# EAGLE schematic waterworx (EAGLE 6.2)
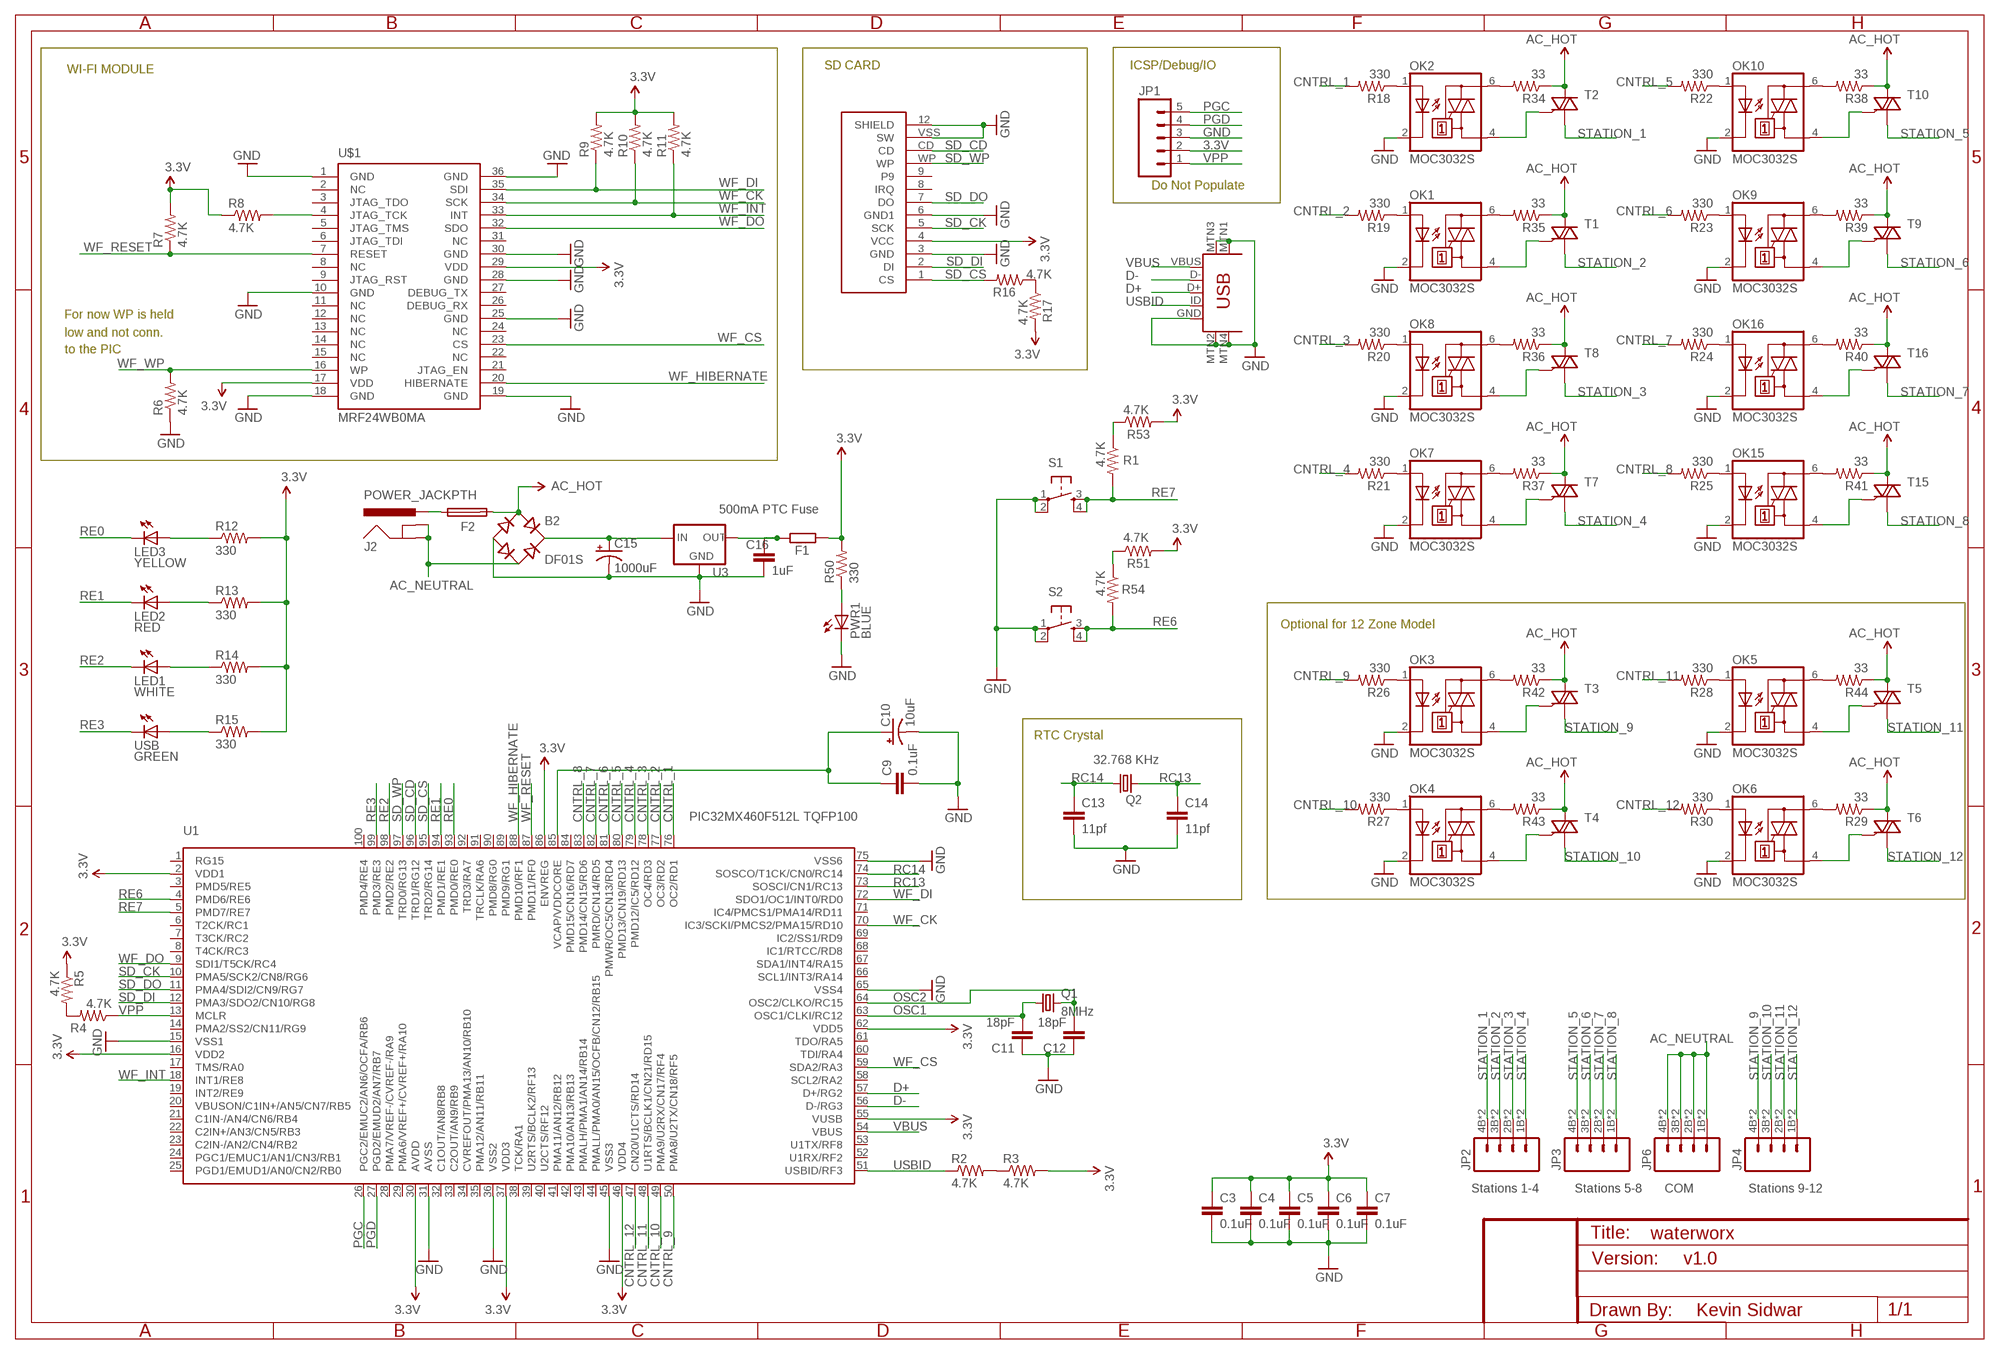
[diagram p0: schematic, sheet 1]

## Parts
B2  DF01S  [DFS]
C3  0.1uF  CAP0603  [0603]
C4  0.1uF  CAP0603  [0603]
C5  0.1uF  CAP0603  [0603]
C6  0.1uF  CAP0603  [0603]
C7  0.1uF  CAP0603  [0603]
C9  0.1uF  CAP0603  [0603]
C10  10uF  CAP_POL3528  [EIA3528]
C11  18pF  CAP0603  [0603]
C12  18pF  CAP0603  [0603]
C13  11pf  CAP0603  [0603]
C14  11pf  CAP0603  [0603]
C15  1000uF  CPOL-USE7.5-18  [E7,5-18]
C16  1uF  CAP0603-CAP  [0603-CAP]
F1  500mA PTC Fuse  R-EU_M1206  [M1206]
F2  LITTLEFUSENANO  [NANO2_HOLDER]
J2  POWER_JACKPTH  [POWER_JACK_PTH]
JP1  M05LOCK  [1X05_LOCK]
JP2  Stations 1-4  M04PHX  [PHOENIX_TERMINAL_4]
JP3  Stations 5-8  M04PHX  [PHOENIX_TERMINAL_4]
JP4  Stations 9-12  M04PHX  [PHOENIX_TERMINAL_4]
JP6  COM  M04PHX  [PHOENIX_TERMINAL_4]
LED1  WHITE  LED0603  [LED-0603]
LED2  RED  LED0603  [LED-0603]
LED3  YELLOW  LED0603  [LED-0603]
OK1  MOC3032S  [DIL6-SMD]
OK2  MOC3032S  [DIL6-SMD]
OK3  MOC3032S  [DIL6-SMD]
OK4  MOC3032S  [DIL6-SMD]
OK5  MOC3032S  [DIL6-SMD]
OK6  MOC3032S  [DIL6-SMD]
OK7  MOC3032S  [DIL6-SMD]
OK8  MOC3032S  [DIL6-SMD]
OK9  MOC3032S  [DIL6-SMD]
OK10  MOC3032S  [DIL6-SMD]
OK15  MOC3032S  [DIL6-SMD]
OK16  MOC3032S  [DIL6-SMD]
PWR1  BLUE  LED0603  [LED-0603]
Q1  8MHz  CRYSTAL5X3  [CRYSTAL-SMD-5X3]
Q2  32.768 KHz  CRYSTAL4X2  [CRYSTAL-SMD-4X2]
R1  4.7K  RESISTOR0603  [0603]
R2  4.7K  RESISTOR0603-RES  [0603-RES]
R3  4.7K  RESISTOR0603-RES  [0603-RES]
R4  4.7K  RESISTOR0603-RES  [0603-RES]
R5  4.7K  RESISTOR0603-RES  [0603-RES]
R6  4.7K  RESISTOR0603-RES  [0603-RES]
R7  4.7K  RESISTOR0603-RES  [0603-RES]
R8  4.7K  RESISTOR0603-RES  [0603-RES]
R9  4.7K  RESISTOR0603-RES  [0603-RES]
R10  4.7K  RESISTOR0603-RES  [0603-RES]
R11  4.7K  RESISTOR0603-RES  [0603-RES]
R12  330  RESISTOR0603-RES  [0603-RES]
R13  330  RESISTOR0603-RES  [0603-RES]
R14  330  RESISTOR0603-RES  [0603-RES]
R15  330  RESISTOR0603-RES  [0603-RES]
R16  4.7K  RESISTOR0603-RES  [0603-RES]
R17  4.7K  RESISTOR0603-RES  [0603-RES]
R18  330  RESISTOR0603-RES  [0603-RES]
R19  330  RESISTOR0603-RES  [0603-RES]
R20  330  RESISTOR0603-RES  [0603-RES]
R21  330  RESISTOR0603-RES  [0603-RES]
R22  330  RESISTOR0603-RES  [0603-RES]
R23  330  RESISTOR0603-RES  [0603-RES]
R24  330  RESISTOR0603-RES  [0603-RES]
R25  330  RESISTOR0603-RES  [0603-RES]
R26  330  RESISTOR0603-RES  [0603-RES]
R27  330  RESISTOR0603-RES  [0603-RES]
R28  330  RESISTOR0603-RES  [0603-RES]
R29  33  RESISTOR0603-RES  [0603-RES]
R30  330  RESISTOR0603-RES  [0603-RES]
R34  33  RESISTOR0603-RES  [0603-RES]
R35  33  RESISTOR0603-RES  [0603-RES]
R36  33  RESISTOR0603-RES  [0603-RES]
R37  33  RESISTOR0603-RES  [0603-RES]
R38  33  RESISTOR0603-RES  [0603-RES]
R39  33  RESISTOR0603-RES  [0603-RES]
R40  33  RESISTOR0603-RES  [0603-RES]
R41  33  RESISTOR0603-RES  [0603-RES]
R42  33  RESISTOR0603-RES  [0603-RES]
R43  33  RESISTOR0603-RES  [0603-RES]
R44  33  RESISTOR0603-RES  [0603-RES]
R50  330  RESISTOR0603-RES  [0603-RES]
R51  4.7K  RESISTOR0603  [0603]
R53  4.7K  RESISTOR0603  [0603]
R54  4.7K  RESISTOR0603  [0603]
S1  TAC_SWITCHB3FS  [SWITCH-OMRON]
S2  TAC_SWITCHB3FS  [SWITCH-OMRON]
T1  LF-TRIACSOT223  [SOT223]
T2  LF-TRIACSOT223  [SOT223]
T3  LF-TRIACSOT223  [SOT223]
T4  LF-TRIACSOT223  [SOT223]
T5  LF-TRIACSOT223  [SOT223]
T6  LF-TRIACSOT223  [SOT223]
T7  LF-TRIACSOT223  [SOT223]
T8  LF-TRIACSOT223  [SOT223]
T9  LF-TRIACSOT223  [SOT223]
T10  LF-TRIACSOT223  [SOT223]
T15  LF-TRIACSOT223  [SOT223]
T16  LF-TRIACSOT223  [SOT223]
U1  PIC32MX460F512L TQFP100  PIC32MX4XXLTQFP100  [TQFP100]
U3  RECOM_X.X_REG78XX  [RECOM]
U$1  MRF24WB0MA  [SMD_MRF]
U$2  SD_CARD_SOCKETALPS  [SD_ALPS]
U$21  USB-MINIB-5PIN  [USB-MINIB]
USB  GREEN  LED0603  [LED-0603]

## Nets
3.3V: C3.1 C4.1 C5.1 C6.1 C7.1 F1.1 JP1.2 R3.2 R5.1 R7.2 R8.1 R9.2 R10.2 R11.2 R12.2 R13.2 R14.2 R15.2 R17.2 R50.2 R51.2 R53.2 U1.2(VDD1) U1.16(VDD2) U1.30(AVDD) U1.37(VDD3) U1.46(VDD4) U1.55(VUSB) U1.62(VDD5) U1.86(ENVREG) U$1.17(VDD) U$1.29(VDD) U$2.4(VCC)
AC_HOT: B2.AC1 F2.2 R29.1 R34.1 R35.1 R36.1 R37.1 R38.1 R39.1 R40.1 R41.1 R42.1 R43.1 R44.1 T1.2(A2) T2.2(A2) T3.2(A2) T4.2(A2) T5.2(A2) T6.2(A2) T7.2(A2) T8.2(A2) T9.2(A2) T10.2(A2) T15.2(A2) T16.2(A2)
AC_NEUTRAL: B2.AC2 J2.GND J2.GNDBREAK JP6.1B JP6.1T JP6.2B JP6.2T JP6.3B JP6.3T JP6.4B JP6.4T
CNTRL_1: R18.2 U1.76(OC2/RD1)
CNTRL_2: R19.2 U1.77(OC3/RD2)
CNTRL_3: R20.2 U1.78(OC4/RD3)
CNTRL_4: R21.2 U1.79(PMD12/IC5/RD12)
CNTRL_5: R22.2 U1.80(PMD13/CN19/RD13)
CNTRL_6: R23.2 U1.81(PMWR/OC5/CN13/RD4)
CNTRL_7: R24.2 U1.82(PMRD/CN14/RD5)
CNTRL_8: R25.2 U1.83(PMD14/CN15/RD6)
CNTRL_9: R26.2 U1.50(PMA8/U2TX/CN18/RF5)
CNTRL_10: R27.2 U1.49(PMA9/U2RX/CN17/RF4)
CNTRL_11: R28.2 U1.48(U1RTS/BCLK1/CN21/RD15)
CNTRL_12: R30.2 U1.47(CN20/U1CTS/RD14)
D+: U1.57(D+/RG2) U$21.D+
D-: U1.56(D-/RG3) U$21.D-
GND: B2.- C3.2 C4.2 C5.2 C6.2 C7.2 C9.2 C10.C(-) C11.1 C12.1 C13.2 C14.2 C15.- C16.2 JP1.3 OK1.2(C) OK2.2(C) OK3.2(C) OK4.2(C) OK5.2(C) OK6.2(C) OK7.2(C) OK8.2(C) OK9.2(C) OK10.2(C) OK15.2(C) OK16.2(C) PWR1.C R6.1 S1.1 S1.2 S2.1 S2.2 U1.15(VSS1) U1.31(AVSS) U1.36(VSS2) U1.45(VSS3) U1.65(VSS4) U1.75(VSS6) U3.GND U$1.1(GND) U$1.10(GND) U$1.18(GND) U$1.19(GND) U$1.25(GND) U$1.28(GND) U$1.30(GND) U$1.36(GND) U$2.3(GND) U$2.6(GND1) U$2.12(SHIELD) U$2.VSS(SW) U$21.GND U$21.MTN1(MTN2) U$21.MTN2(MTN3) U$21.MTN3(MTN1) U$21.MTN4
N$1: OK9.1(A) R23.1
N$2: OK1.1(A) R19.1
N$3: R51.1 R54.1
N$4: R1.1 R53.1
N$5: R8.2 U$1.4(JTAG_TCK)
N$6: OK1.6(A2) R35.2
N$7: OK9.6(A2) R39.2
N$8: OK1.4(A1) T1.3(G)
N$9: OK2.1(A) R18.1
N$10: R16.1 R17.1
N$11: R4.2 R5.2
N$12: OK2.6(A2) R34.2
N$13: OK9.4(A1) T9.3(G)
N$14: OK2.4(A1) T2.3(G)
N$15: R2.2 R3.1
N$16: B2.+ C15.+ U3.VIN(IN)
N$17: OK3.1(A) R26.1
N$18: OK3.6(A2) R42.2
N$19: PWR1.A R50.1
N$20: R15.1 USB.A
N$21: OK3.4(A1) T3.3(G)
N$22: LED1.A R14.1
N$23: LED2.A R13.1
N$24: C16.1 F1.2 U3.VOUT(OUT)
N$25: OK6.1(A) R30.1
N$26: OK4.1(A) R27.1
N$27: OK4.6(A2) R43.2
N$28: OK10.1(A) R22.1
N$29: OK4.4(A1) T4.3(G)
N$30: OK6.6(A2) R29.2
N$31: OK6.4(A1) T6.3(G)
N$32: OK5.1(A) R28.1
N$33: OK5.6(A2) R44.2
N$34: OK10.6(A2) R38.2
N$35: LED3.A R12.1
N$36: OK5.4(A1) T5.3(G)
N$37: F2.1 J2.PWR
N$41: OK10.4(A1) T10.3(G)
N$45: OK7.1(A) R21.1
N$46: OK7.6(A2) R37.2
N$48: OK7.4(A1) T7.3(G)
N$51: OK8.1(A) R20.1
N$52: OK8.6(A2) R36.2
N$54: OK8.4(A1) T8.3(G)
N$76: OK15.1(A) R25.1
N$77: OK15.6(A2) R41.2
N$78: OK15.4(A1) T15.3(G)
N$81: OK16.1(A) R24.1
N$82: OK16.6(A2) R40.2
N$83: OK16.4(A1) T16.3(G)
N$110: C9.1 C10.A(+) U1.85(VCAP/VDDCORE)
OSC1: C11.2 Q1.1 U1.63(OSC1/CLKI/RC12)
OSC2: C12.2 Q1.3 U1.64(OSC2/CLKO/RC15)
PGC: JP1.5 U1.26(PGC2/EMUC2/AN6/OCFA/RB6)
PGD: JP1.4 U1.27(PGD2/EMUD2/AN7/RB7)
RC13: C14.1 Q2.P$2 U1.73(SOSCI/CN1/RC13)
RC14: C13.1 Q2.P$1 U1.74(SOSCO/T1CK/CN0/RC14)
RE0: LED3.C U1.93(PMD0/RE0)
RE1: LED2.C U1.94(PMD1/RE1)
RE2: LED1.C U1.98(PMD2/RE2)
RE3: U1.99(PMD3/RE3) USB.C
RE6: R54.2 S2.3 S2.4 U1.4(PMD6/RE6)
RE7: R1.2 S1.3 S1.4 U1.5(PMD7/RE7)
SD_CD: U1.96(TRD1/RG12) U$2.CD
SD_CK: U1.10(PMA5/SCK2/CN8/RG6) U$2.5(SCK)
SD_CS: R16.2 U1.95(TRD2/RG14) U$2.1(CS)
SD_DI: U1.12(PMA3/SDO2/CN10/RG8) U$2.2(DI)
SD_DO: U1.11(PMA4/SDI2/CN9/RG7) U$2.7(DO)
SD_WP: U1.97(TRD0/RG13) U$2.WP
STATION_1: JP2.4B JP2.4T T2.1(A1)
STATION_2: JP2.3B JP2.3T T1.1(A1)
STATION_3: JP2.2B JP2.2T T8.1(A1)
STATION_4: JP2.1B JP2.1T T7.1(A1)
STATION_5: JP3.4B JP3.4T T10.1(A1)
STATION_6: JP3.3B JP3.3T T9.1(A1)
STATION_7: JP3.2B JP3.2T T16.1(A1)
STATION_8: JP3.1B JP3.1T T15.1(A1)
STATION_9: JP4.4B JP4.4T T3.1(A1)
STATION_10: JP4.3B JP4.3T T4.1(A1)
STATION_11: JP4.2B JP4.2T T5.1(A1)
STATION_12: JP4.1B JP4.1T T6.1(A1)
USBID: R2.1 U1.51(USBID/RF3) U$21.ID
VBUS: U1.54(VBUS) U$21.VBUS
VPP: JP1.1 R4.1 U1.13(MCLR)
WF_CK: R10.1 U1.70(IC3/SCKI/PMCS2/PMA15/RD10) U$1.34(SCK)
WF_CS: U1.59(SDA2/RA3) U$1.23(CS)
WF_DI: R9.1 U1.72(SDO1/OC1/INT0/RD0) U$1.35(SDI)
WF_DO: U1.9(SDI1/T5CK/RC4) U$1.32(SDO)
WF_HIBERNATE: U1.88(PMD10/RF1) U$1.20(HIBERNATE)
WF_INT: R11.1 U1.18(INT1/RE8) U$1.33(INT)
WF_RESET: R7.1 U1.87(PMD11/RF0) U$1.7(RESET)
WF_WP: R6.2 U$1.16(WP)
Unconnected: U1.1(RG15) U1.3(PMD5/RE5) U1.6(T2CK/RC1) U1.7(T3CK/RC2) U1.8(T4CK/RC3) U1.14(PMA2/SS2/CN11/RG9) U1.17(TMS/RA0) U1.19(INT2/RE9) U1.20(VBUSON/C1IN+/AN5/CN7/RB5) U1.21(C1IN-/AN4/CN6/RB4) U1.22(C2IN+/AN3/CN5/RB3) U1.23(C2IN-/AN2/CN4/RB2) U1.24(PGC1/EMUC1/AN1/CN3/RB1) U1.25(PGD1/EMUD1/AN0/CN2/RB0) U1.28(PMA7/VREF-/CVREF-/RA9) U1.29(PMA6/VREF+/CVREF+/RA10) U1.32(C1OUT/AN8/RB8) U1.33(C2OUT/AN9/RB9) U1.34(CVREFOUT/PMA13/AN10/RB10) U1.35(PMA12/AN11/RB11) U1.38(TCK/RA1) U1.39(U2RTS/BCLK2/RF13) U1.40(U2CTS/RF12) U1.41(PMA11/AN12/RB12) U1.42(PMA10/AN13/RB13) U1.43(PMALH/PMA1/AN14/RB14) U1.44(PMALL/PMA0/AN15/OCFB/CN12/RB15) U1.52(U1RX/RF2) U1.53(U1TX/RF8) U1.58(SCL2/RA2) U1.60(TDI/RA4) U1.61(TDO/RA5) U1.66(SCL1/INT3/RA14) U1.67(SDA1/INT4/RA15) U1.68(IC1/RTCC/RD8) U1.69(IC2/SS1/RD9) U1.71(IC4/PMCS1/PMA14/RD11) U1.84(PMD15/CN16/RD7) U1.89(PMD9/RG1) U1.90(PMD8/RG0) U1.91(TRCLK/RA6) U1.92(TRD3/RA7) U1.100(PMD4/RE4) U$1.2(NC) U$1.3(JTAG_TDO) U$1.5(JTAG_TMS) U$1.6(JTAG_TDI) U$1.8(NC) U$1.9(JTAG_RST) U$1.11(NC) U$1.12(NC) U$1.13(NC) U$1.14(NC) U$1.15(NC) U$1.21(JTAG_EN) U$1.22(NC) U$1.24(NC) U$1.26(DEBUG_RX) U$1.27(DEBUG_TX) U$1.31(NC) U$2.8(IRQ) U$2.9

## Notes on the sheet
- SD CARD | ICSP/Debug/IO
- WI-FI MODULE
- Do Not Populate
- For now WP is held
- low and not conn.
- to the PIC
- Optional for 12 Zone Model
- RTC Crystal
- v1.0
- Kevin Sidwar

## Library data of the parts
B2 = lizardworx:DF*S: Surface Mount Glass Passivated Bridge Rectifiers Source: Source: Comchip Bridge Rectifiers DF005S-G thru DF10S-G.pdf
C3-C6 C9 C11-C14 = SparkFun:CAP: Capacitor Standard 0603 ceramic capacitor, and 0.1" leaded capacitor.
C7 = SparkFun02-20-08:CAP: Capacitor Standard 0603 ceramic capacitor, and 0.1" leaded capacitor.
C10 = SparkFun02-20-08:CAP_POL: Capacitor Polarized These are standard SMD and PTH capacitors. Normally 10uF, 47uF, and 100uF in electrolytic and tantalum varieties. Always verify the external diameter of the through hole cap, it varies with capacity, voltage, and manufacturer. The EIA devices should be standard.
C15 = rcl:CPOL-US: POLARIZED CAPACITOR, American symbol
C16 = SparkFun-Passives:CAP: Capacitor Standard 0603 ceramic capacitor, and 0.1" leaded capacitor.
F1 = resistor:R-EU_: RESISTOR, European symbol
F2 = lizardworx:LITTLEFUSE: LITTLEFUSE Picofuse/slow Littlefuse
J2 = lizardworx:POWER_JACK: Power Jack This is the standard 5.5mm barrel jack for power. The PTH is the most common, proven, reliable, footprint. All others are experimental. The Slot footprint only works if the mill layer is transmitted to the PCB fab house so be warned. Spark Fun Electronics SKU : PRT-00119. Mating wall wart : TOL-00298 (and others)
JP1 = SparkFun-Connectors:M05: Header 5 Standard 5-pin 0.1" header. Use with straight break away headers (SKU : PRT-00116), right angle break away headers (PRT-00553), swiss pins (PRT-00743), machine pins (PRT-00117), and female headers (PRT-00115). Molex polarized connector foot print use with SKU : PRT-08230 with associated crimp pins and housings.
JP2-JP4 JP6 = lizardworx:M04: Header 4 Standard 4-pin 0.1" header. Use with straight break away headers (SKU : PRT-00116), right angle break away headers (PRT-00553), swiss pins (PRT-00743), machine pins (PRT-00117), and female headers (PRT-00115). Molex polarized connector foot print use with SKU : PRT-08231 with associated crimp pins and housings. 1MM SMD Version SKU: PRT-10208
LED1-LED3 PWR1 USB = SparkFun:LED: LEDs Standard schematic elements and footprints for 5mm, 3mm, 1206, and 0603 sized LEDs. 5mm - Spark Fun Electronics SKU : COM-00529 (and others)
OK1-OK10 OK15 OK16 = lizardworx:MOC30*: 6-Pin DIP Zero-Cross Optoisolators Triac Driver Output (250/400 Volt Peak) Source: http://www.fairchildsemi.com/ds/MO/MOC3043-M.pdf; MF: FAIRCHILD SEMICONDUCTOR; MPN: MOC3032S-M; OC_FARNELL: unknown; OC_NEWARK: 05C2871
Q1 = SparkFun11_03_09:CRYSTAL: Crystals Various standard crystals. Proven footprints. Spark Fun Electronics SKU : COM-00534
Q2 = lizardworx:CRYSTAL: Various standard crystals. Proven footprints. Spark Fun Electronics SKU : COM-00534
R1 R51 R53 R54 = SparkFun:RESISTOR: Resistor
R2-R30 R34-R44 R50 = SparkFun-Passives:RESISTOR: Resistor
S1 S2 = lizardworx:TAC_SWITCH: Momentary Switch Button commonly used for reset or general input. Spark Fun Electronics SKU : COM-00097
T1-T10 T15 T16 = lizardworx:LF-TRIAC: TRIAC Source: http://www.semiconductors.philips.com BT138_SERIES_2.pdf
U1 = SchmalzHaus:PIC32MX4XXL
U3 = lizardworx:RECOM_X.X_REG
U$1 = lizardworx:MRF24WB0MA
U$2 = lizardworx:SD_CARD_SOCKET: SD/MMC Socket Media socket for SD and MMC cards. Push-push type. Schematic element and footprint production proven. Spark Fun Electronics SKU : PRT-00136
U$21 = SparkFun-Connectors:USB-MINIB: Mini-USB "B" connector with 5th pin broken out. Created new symbol breaking out 5th "ID" pin in mini/micro USB connector spec. See: http://en.wikipedia.org/wiki/Mini_usb#Cables. Uses same footprint as 4-pin symbol. Also added pins to connect to mounting / shield pads if required (probably not generally needed as signals aren't shielded once they leave the connector).